# EAGLE schematic delayTrottelWithInverter (EAGLE 9.5.2)
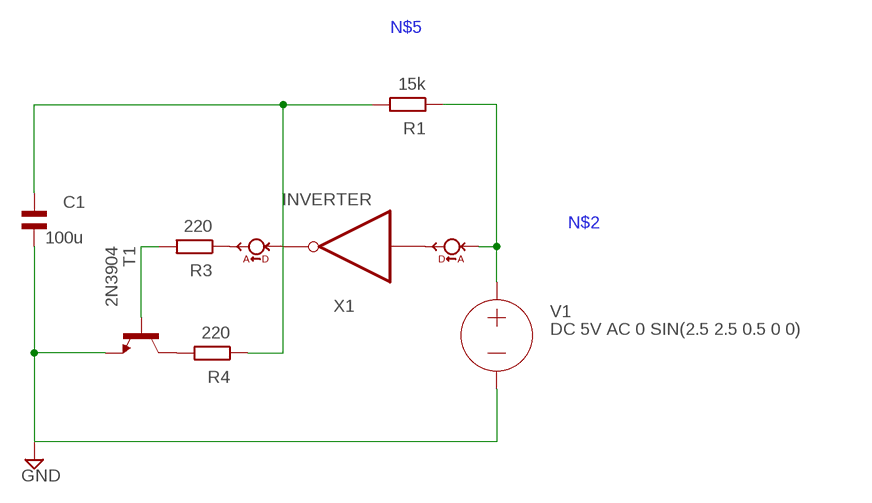
[diagram p0: schematic, sheet 1]

## Parts
C1  100u  EL-BI25-10AXIAL  [EU25-10]
R1  15k  R  (no package)
R3  220  R  (no package)
R4  220  R  (no package)
T1  2N3904  [TO92]
V1  DC 5V AC 0 SIN(2.5 2.5 0.5 0 0)  VOLTAGE  (no package)
X1  INVERTER  (no package)
X2  DTOAB  (no package)
X3  ATODB  (no package)

## Nets
GND: C1.2 T1.3(E) V1.-
N$1: X1.I X3.DIG
N$2: R1.1 V1.+ X3.AN
N$3: X1.O X2.DIG
N$5: C1.1 R1.2 R4.1
N$6: R3.1 X2.AN
N$7: R3.2 T1.2(B)
N$8: R4.2 T1.1(C)

## Library data of the parts
C1 = rcl:EL-: BIPOLAR ELECTROLYTIC CAPACITOR; SPICEPREFIX: C
R1 R3 R4 = ngspice-simulation:R: RESISTOR
T1 = transistor:2N3904: NPN TRANSISTOR; SPICEMODEL: 2N3904; SPICEPREFIX: Q
V1 = ngspice-simulation:VOLTAGE: Independent Voltage Source, either DC, AC, PULSE, SINE, PWL, EXP, or SFFM; VALUE: 0V
X1 = ngspice-digital:INVERTER: logic inverter (NOT gate)
X2 = ngspice-digital:DTOAB: Digital to Analog Bridge
X3 = ngspice-digital:ATODB: Analog to digital bridge